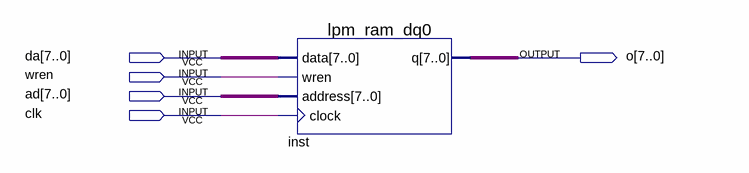
[diagram p0: schematic sheet]
// Quartus schematic Block2.bdf as structural Verilog: 1 symbols, 5 pins
module Block2 (
  input  [7:0] da,
  input  wren,
  input  [7:0] ad,
  input  clk,
  output [7:0] o
);

  lpm_ram_dq0 inst (.data(da), .wren(wren), .address(ad), .clock(clk), .q(o));
endmodule
